# Altium schematic sheet Power.SchDoc
size A4; SheetNumber: 1; SheetTotal: 4
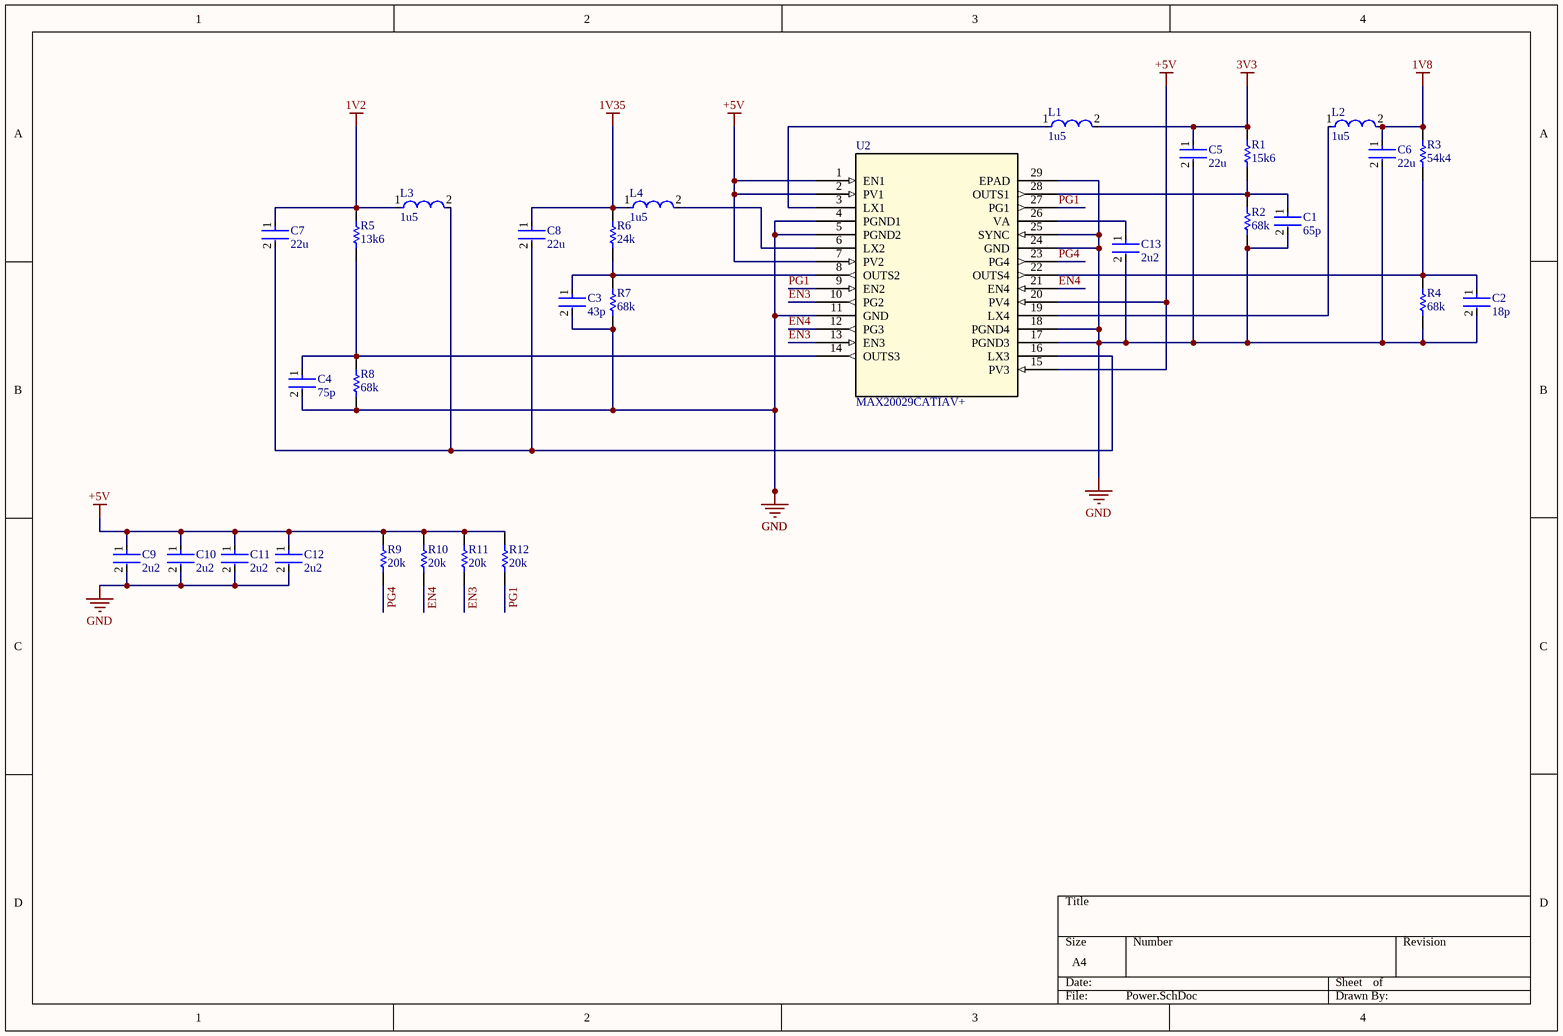
[diagram p0: Power.SchDoc]

## Parts
C1  65p  [FP-C0603C-CF-MFG]
C2  18p  [FP-C0603C-CF-MFG]
C3  43p  [FP-C0603C-CF-MFG]
C4  75p  [FP-C0603C-CF-MFG]
C5  22u  [FP-CC0805-0_85-MFG]
C6  22u  [FP-CC0805-0_85-MFG]
C7  22u  [FP-CC0805-0_85-MFG]
C8  22u  [FP-CC0805-0_85-MFG]
C9  2u2  [FP-CC0805-0_85-MFG]
C10  2u2  [FP-CC0805-0_85-MFG]
C11  2u2  [FP-CC0805-0_85-MFG]
C12  2u2  [FP-CC0805-0_85-MFG]
C13  2u2  [FP-CC0805-0_85-MFG]
L1  1u5  [FP-LQM2HPN_G0-IPC_A]
L2  1u5  [FP-LQM2HPN_G0-IPC_A]
L3  1u5  [FP-LQM2HPN_G0-IPC_A]
L4  1u5  [FP-LQM2HPN_G0-IPC_A]
R1  15k6  [RESC1609X50X30NL8T20]
R2  68k  [RESC1609X50X30NL8T20]
R3  54k4  [RESC1609X50X30NL8T20]
R4  68k  [RESC1609X50X30NL8T20]
R5  13k6  [RESC1609X50X30NL8T20]
R6  24k  [RESC1609X50X30NL8T20]
R7  68k  [RESC1609X50X30NL8T20]
R8  68k  [RESC1609X50X30NL8T20]
R9  20k  [RESC1609X50X30NL8T20]
R10  20k  [RESC1609X50X30NL8T20]
R11  20k  [RESC1609X50X30NL8T20]
R12  20k  [RESC1609X50X30NL8T20]
U2  MAX20029CATIAV+  [QUADBUCK QFN28]

## Nets
1V2: C7.1 L3.1 R5.1
1V8: C6.1 L2.2 R3.1
1V35: C8.1 L4.1 R6.1
3V3: C5.1 L1.2 R1.1
+5V: C9.1 C10.1 C11.1 C12.1 R9.1 R10.1 R11.1 R12.1 U2.1(EN1) U2.2(PV1) U2.7(PV2) U2.15(PV3) U2.20(PV4)
GND: C1.2 C2.2 C3.2 C4.2 C5.2 C6.2 C9.2 C10.2 C11.2 C12.2 C13.2 R2.2 R4.2 R7.2 R8.2 U2.4(PGND1) U2.5(PGND2) U2.11(GND) U2.17(PGND3) U2.18(PGND4) U2.24(GND) U2.25(SYNC) U2.29(EPAD)
EN3: R11.2 U2.10(PG2) U2.13(EN3)
EN4: R10.2 U2.12(PG3) U2.21(EN4)
PG1: R12.2 U2.9(EN2) U2.27(PG1)
PG4: R9.2 U2.23(PG4)
NetC1_1: C1.1 R1.2 R2.1 U2.28(OUTS1)
NetC2_1: C2.1 R3.2 R4.1 U2.22(OUTS4)
NetC3_1: C3.1 R6.2 R7.1 U2.8(OUTS2)
NetC4_1: C4.1 R5.2 R8.1 U2.14(OUTS3)
NetC7_2: C7.2 C8.2 L3.2 U2.16(LX3)
NetC13_1: C13.1 U2.26(VA)
NetL1_1: L1.1 U2.3(LX1)
NetL2_1: L2.1 U2.19(LX4)
NetL4_2: L4.2 U2.6(LX2)

## Library data of the parts
C1-C4 = CMP-2006-03061-2: CAP CER 0.1UF 50V X7R 0603; Manufacturer: KEMET; Manufacturer Part Number: C0603C104K5RACTU; Tolerance: 0.1; Temperature Coefficient: 30ppm/°C; Material: Ceramic; Automotive Grade: Grade 1; Value: 0.10 μF; Temperature: -55°C to +125°C; RoHS: TRUE; Temperature Range High: +125°C; Lead Free: Yes; Octopart: https://octopart.com/c0603c104k5ractu-kemet-139244; Digikey Description: CAP CER 0.1UF 50V X7R 0603; Category: Cap; Package: C0603C-CF; ComponentLink2Description: Datasheet; Temperature Range Low: -55°C; Device Class L1: Passive Components; Voltage Rating: 50 V; Automotive: Yes; Device Class L3: Ceramic Capacitors; ComponentLink2URL: https://api.kemet.com/component-edge/download/datasheet/C0603C100J5GACAUTO.pdf; Capacitance: 0.10 μF; Device Class L2: Capacitors; Temperature Characteristic: X7R; Height: 0.87mm
C5-C13 = CMP-2100-03606-3: CAP CER 0.1UF 50V X7R 0805; Manufacturer Part Number: CC0805KRX7R9BB104; Manufacturer: Yageo; Tolerance: 0.1; Capacitance: 100 nF; Value: 100 nF; Description: CC0805 100 nF X7R 10.00% 50 V; Material: Ceramic; Device Class L1: Passive Components; ComponentLink2Description: Datasheet; Package: CC0805-0.85; Digikey Description: CAP CER 0.1UF 50V X7R 0805; Device Class L3: Ceramic Capacitors; Temperature: -30°C to +85°C; Temperature Characteristic: X7R; Voltage Rating: 50 V; Height: 0.95mm; RoHS: TRUE; Ipc Land Pattern Name: CAPC200125X85; Device Class L2: Capacitors; Category: Cap; Temperature Range Low: -30°C; Temperature Range High: +85°C; Mouser Description: Multilayer Ceramic Capacitors MLCC - SMD/SMT 100nF 50V X7R 10%; Footprint Url: http://www.yageo.com/exep/pages/download/literatures/UPY-C_GEN_24.pdf; Automotive: No; Octopart: https://octopart.com/cc0805krx7r9bb104-yageo-192993; Lead Free: Yes; ComponentLink2URL: http://www.yageo.com/documents/recent/UPY-GPHC_Y5V_6.3V-to-50V_8.pdf
L1-L4 = CMP-06042-016283-1: FIXED IND 1UH 1.6A 55 MOHM SMD; Shielding: Shielded; Tolerance: 20%; Test Frequency: 1MHz; Self Resonant Frequency: 60MHz; Core Material: Ferrite; DC Resistance (DCR): 69mR; Width: 2mm; Length: 2.5mm; Mount: Surface Mount; Packaging: Tape and Reel; Depth: 2.2mm; Height: 1.2mm; Termination: SMD/SMT; Case Code (Metric): 2520; Current Rating: 1.6A; Package Quantity: 3000; Min Operating Temperature: -55°C; Inductance Tolerance: 20%; RoHS Compliant: Yes; Radiation Hardening: No; REACH SVHC: No SVHC; Rated Current-Max: 1.6A; Inductance: 1uH; Series: LQM2HP_G0; Max DC Current: 1.6A; Case Code (Imperial): 1008; Max Operating Temperature: 125°C; DC Current: 1.6A; Military Standard: Not; Case/Package: 1008; Lead Free: Lead Free; Height - Seated (Max): 0.039inch
R1-R12 = CMP-1666-00005-4: Chip Resistor, 10 KOhm, +/- 1%, 100 mW, -55 to 155 degC, 0603 (1608 Metric), RoHS, Tape and Reel; Manufacturer: Vishay Semiconductor; Voltage Rating: 75 V; Max Operating Temperature: 155 degC; PackageDescription: 2-Pin Surface Mount Device, Body 1.575 x 0.85 mm; ComponentLink1Description: Manufacturer URL; RoHSCompliant: true; PackageReference: 0603; REACH SVHC: Unknown; Length: 1.55 mm; DatasheetVersion: 06/2012; Packaging: Tape and Reel; Min Operating Temperature: -55 degC; Mounting Technology: Surface Mount; ComponentLink2URL: https://datasheet.ciiva.com/11809/0900766b80d98afc-11809037.pdf; Height: 0.45 mm; ComponentLink2Description: Datasheet; Package Quantity: 5000; ComponentLink1URL: http://www.vishay.com/
U2 = MAX20029CATIAV+: No Description Available; Mfr_Name: Analog Devices / Maxim Integrated; RefDes: RefDes; Type: Type